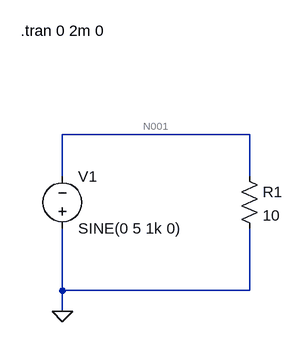
[diagram p0: schematic Draft1.asc]
Draft1.asc, the LTspice schematic file:
Version 4
SHEET 1 880 680
WIRE 352 0 64 0
WIRE 64 64 64 0
WIRE 352 64 352 0
WIRE 64 240 64 144
WIRE 352 240 352 144
WIRE 352 240 64 240
WIRE 64 272 64 240
FLAG 64 272 0
SYMBOL voltage 64 160 M180
WINDOW 0 24 96 Left 2
WINDOW 3 24 16 Left 2
WINDOW 123 0 0 Left 0
WINDOW 39 0 0 Left 0
SYMATTR InstName V1
SYMATTR Value SINE(0 5 1k 0)
SYMBOL res 336 48 R0
SYMATTR InstName R1
SYMATTR Value 10
TEXT 0 -160 Left 2 !.tran 0 2m 0

The netlist it stands for:
* Draft1.asc
V1 0 N001 SINE(0 5 1k 0)
R1 N001 0 10
.tran 0 2m 0
.backanno
.end

* Results of the author's LTspice run, read from the files saved beside the schematic
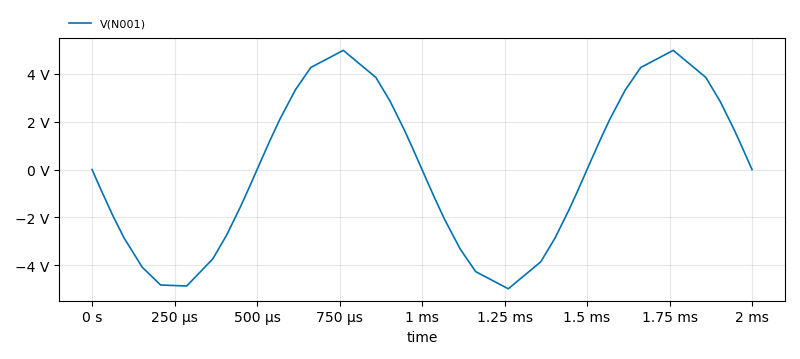
[diagram p1: Transient Analysis of Draft1.asc, plotted from the saved traces]
* Transient Analysis, 1 run:
*   V(N001): min -4.983 V, max 4.983 V, average -6.105 mV, rms 3.478 V, last 0 V